# EAGLE schematic PCB PUMP LED SENSOR (EAGLE 9.5.1)
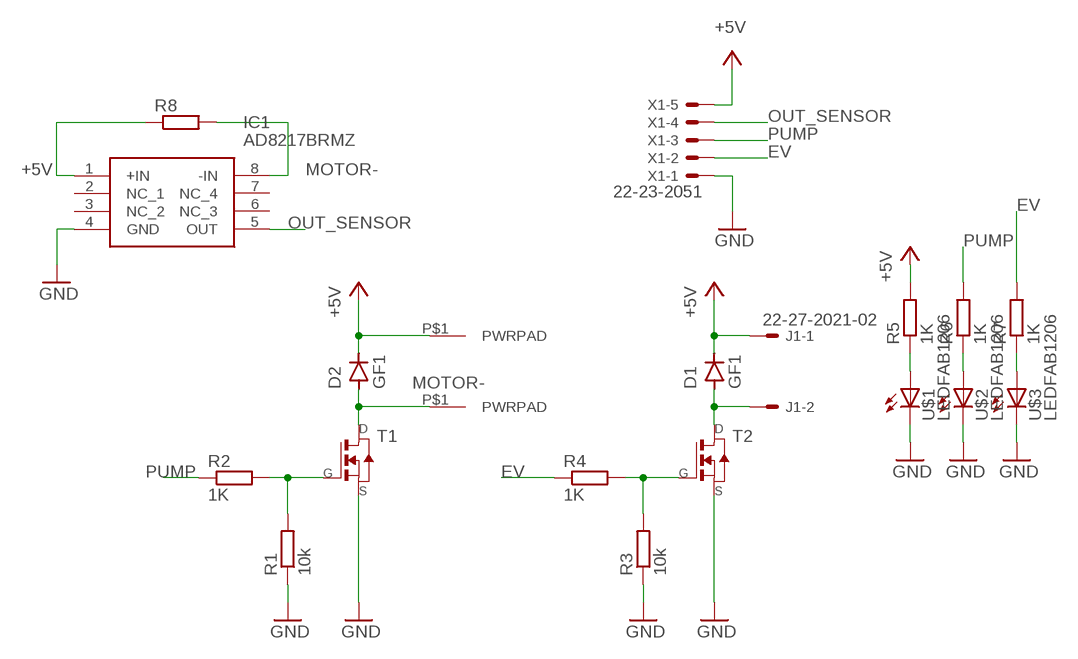
[diagram p0: schematic, sheet 1]

## Parts
D1  GF1  [SMA-DO214AC]
D2  GF1  [SMA-DO214AC]
IC1  AD8217BRMZ  [SOP65P490X110-8N]
J1  22-27-2021-02  [6410-02]
J3  PWRPAD2-5MM  [PWRPAD_2-5MM]
J4  PWRPAD2-5MM  [PWRPAD_2-5MM]
R1  10k  R-EU_R1206  [R1206]
R2  1K  R-EU_R1206  [R1206]
R3  10k  R-EU_R1206  [R1206]
R4  1K  R-EU_R1206  [R1206]
R5  1K  R-EU_R1206  [R1206]
R6  1K  R-EU_R1206  [R1206]
R7  1K  R-EU_R1206  [R1206]
R8  R-EU_R0805  [R0805]
T1  NMOSFETSOT23  [SOT-23]
T2  NMOSFETSOT23  [SOT-23]
U$1  LEDFAB1206  [LED1206FAB]
U$2  LEDFAB1206  [LED1206FAB]
U$3  LEDFAB1206  [LED1206FAB]
X1  22-23-2051  [22-23-2051]

## Nets
+5V: D1.K(C) D2.K(C) IC1.1(+IN) J1.1 J4.P$1(PWRPAD) R5.2 R8.1 X1.5
EV: R4.1 R7.2 X1.2
GND: IC1.4(GND) R1.1 R3.1 T1.2(S) T2.2(S) U$1.2(C) U$2.2(C) U$3.2(C) X1.1
MOTOR-: D2.A IC1.8(-IN) J3.P$1(PWRPAD) R8.2 T1.1(D)
N$1: D1.A J1.2 T2.1(D)
N$3: R1.2 R2.2 T1.3(G)
N$4: R3.2 R4.2 T2.3(G)
N$5: R5.1 U$1.1(A)
N$6: R6.1 U$2.1(A)
N$7: R7.1 U$3.1(A)
OUT_SENSOR: IC1.5(OUT) X1.4
PUMP: R2.1 R6.2 X1.3
Unconnected: IC1.2(NC_1) IC1.3(NC_2) IC1.6(NC_3) IC1.7(NC_4)

## Library data of the parts
D1 D2 = diode:GF1: DIODE
IC1 = AD8217BRMZ:AD8217BRMZ: Analog Devices AD8217BRMZ Current Loop Transmitter 80V 8-Pin MSOP Source: Datasheet <https://componentsearchengine.com/Datasheets/1/AD8217BRMZ.pdf>; DESCRIPTION: Analog Devices AD8217BRMZ Current Loop Transmitter 80V 8-Pin MSOP; HEIGHT: 1.1mm; MANUFACTURER_NAME: Analog Devices; MANUFACTURER_PART_NUMBER: AD8217BRMZ; MOUSER_PART_NUMBER: 584-AD8217BRMZ; MOUSER_PRICE-STOCK: https://www.mouser.com/Search/Refine.aspx?Keyword=584-AD8217BRMZ
J1 = con-molex:22-?-02: CONNECTOR wire to board 2.54 mm (.1 inch) pitch header; MF: MOLEX; OC_FARNELL: unknown; OC_NEWARK: unknown
J3 J4 = fab:PWRPAD
R1-R8 = rcl:R-EU_: RESISTOR, European symbol; SPICEPREFIX: R
T1 T2 = fab:NMOSFET: MOS FET
U$1-U$3 = fab:LED: LED
X1 = con-molex:22-23-2051: .100" (2.54mm) Center Header - 5 Pin; MF: MOLEX; MPN: 22-23-2051; OC_FARNELL: 1462952; OC_NEWARK: 38C9178